# Altium project carrier.PrjPcb (part 1 of 3)
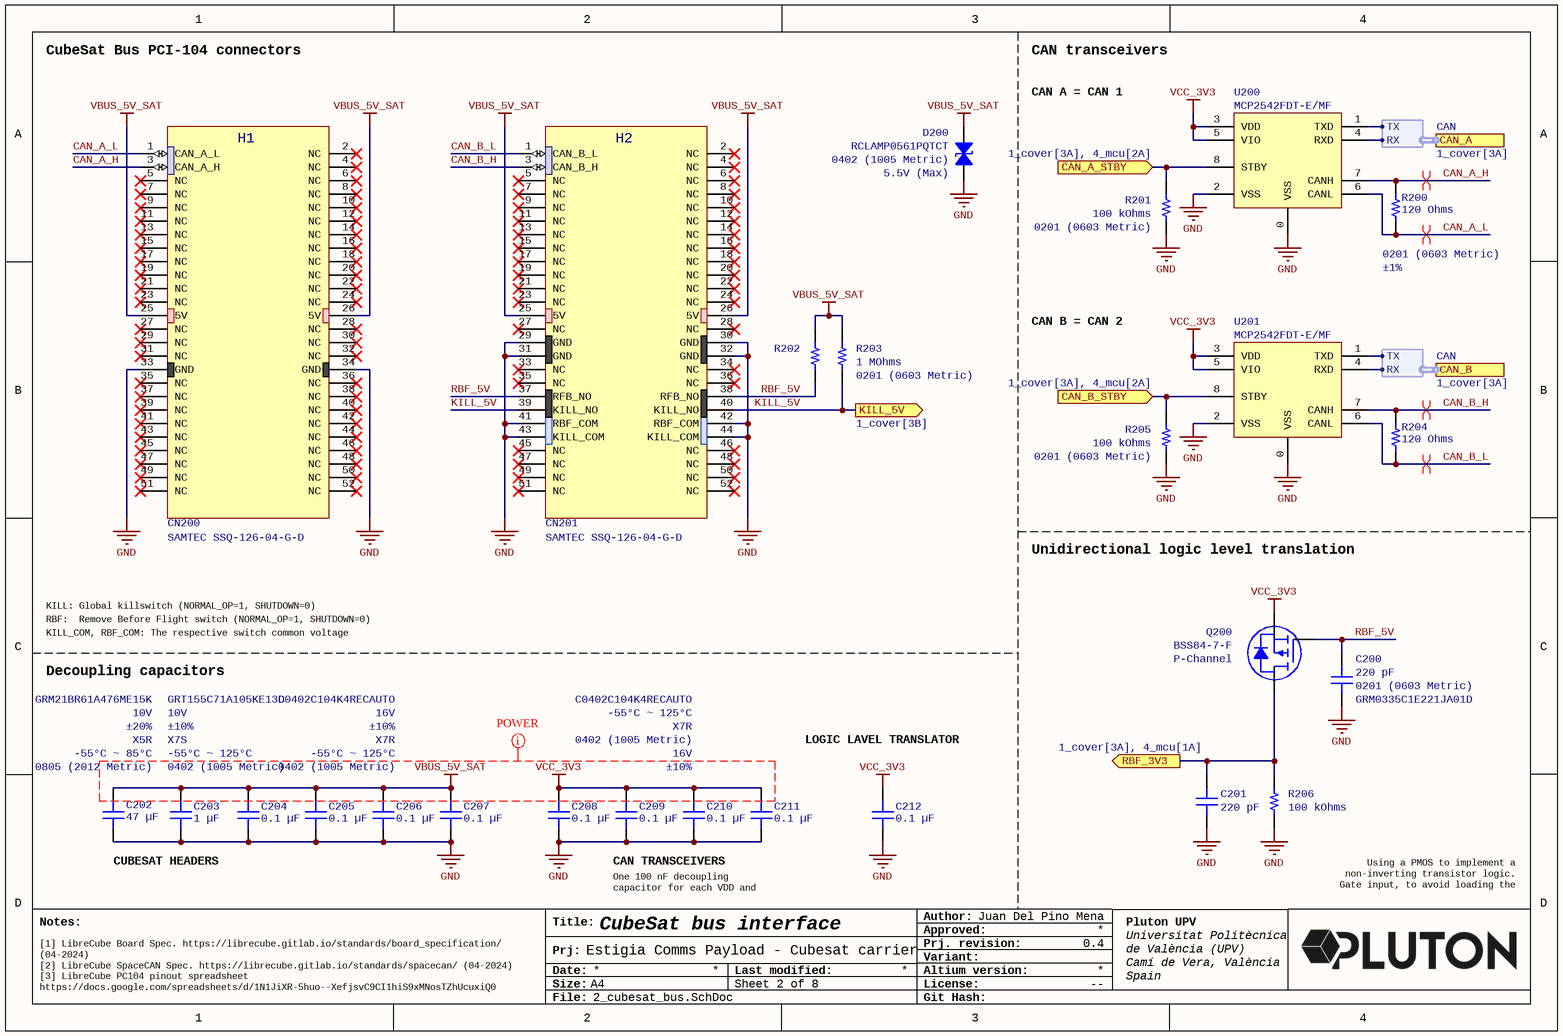
[diagram p0: 2_cubesat_bus.SchDoc]
Author: Juan Del Pino Mena; Organization: Pluton UPV; ProjectTitle: Estigia Comms Payload - Cubesat carrier; ProjectVersion: 0.4
6 sheets, 160 parts. Net scope: hierarchical (ports join the sheet entries above them; power ports are global).
Board file: carrier_pcb.PcbDoc
Sheets:
  2_cubesat_bus.SchDoc
  4_mcu.SchDoc
  5_rf_path.SchDoc
  6_power.SchDoc
  7_power_prot_mon.SchDoc
  8_ports.SchDoc

## Sheet 2_cubesat_bus.SchDoc: CubeSat bus interface
size A4; OrganizationName: Pluton UPV; Address1: Universitat Politècnica; Address2: de València (UPV); Address3: Camí de Vera, València; Address4: Spain; DocumentNumber: 2; Revision: 0.3; SheetNumber: 2; SheetTotal: 8

### Parts
C200  220 pF  Part Number: GRM0335C1E221JA01D  Device Package: 0201 (0603 Metric)  [CAP 0201_0603]
C201  220 pF  [CAP 0201_0603]
C202  Part Number: GRM21BR61A476ME15K  Device Package: 0805 (2012 Metric)  Operating Temperature: -55°C ~ 85°C  Temperature Coefficient: X5R  Tolerance: ±20%  Voltage - Rated: 10V  [CAP 0805_2012]  (hidden comment: 47 µF)
C203  Part Number: GRT155C71A105KE13D  Device Package: 0402 (1005 Metric)  Operating Temperature: -55°C ~ 125°C  Temperature Coefficient: X7S  Tolerance: ±10%  Voltage - Rated: 10V  [CAP 0402_1005]  (hidden comment: 1 µF)
C204  Part Number: C0402C104K4RECAUTO  Operating Temperature: -55°C ~ 125°C  Package / Case: 0402 (1005 Metric)  Temperature Coefficient: X7R  Tolerance: ±10%  Voltage - Rated: 16V  [CAP 0402_1005]  (hidden comment: 0.1 µF)
C205  0.1 µF  [CAP 0402_1005]
C206  0.1 µF  [CAP 0402_1005]
C207  0.1 µF  [CAP 0402_1005]
C208  0.1 µF  [CAP 0402_1005]
C209  Part Number: C0402C104K4RECAUTO  Operating Temperature: -55°C ~ 125°C  Package / Case: 0402 (1005 Metric)  Temperature Coefficient: X7R  Tolerance: ±10%  Voltage - Rated: 16V  [CAP 0402_1005]  (hidden comment: 0.1 µF)
C210  0.1 µF  [CAP 0402_1005]
C211  0.1 µF  [CAP 0402_1005]
C212  0.1 µF  [CAP 0402_1005]
CN200  SAMTEC SSQ-126-04-G-D  [SAMTEC SSQ-126-04-G-D]
CN201  SAMTEC SSQ-126-04-G-D  [SAMTEC SSQ-126-04-G-D]
D200  Device Package: 0402 (1005 Metric)  Voltage - Reverse Standoff (Typ): 5.5V (Max)  [0402]  (hidden comment: RCLAMP0561PQTCT)
Q200  FET Type: P-Channel  [DIODES SOT-23-3]  (hidden comment: BSS84-7-F)
R200  Device Package: 0201 (0603 Metric)  Tolerance: ±1%  [RES 0201_0603]  (hidden comment: 120 Ohms)
R201  Device Package: 0201 (0603 Metric)  [RES 0201_0603]  (hidden comment: 100 kOhms)
R202  1 MOhms  [RES 0201_0603]  (value not drawn)
R203  Device Package: 0201 (0603 Metric)  [RES 0201_0603]  (hidden comment: 1 MOhms)
R204  120 Ohms  [RES 0201_0603]
R205  Device Package: 0201 (0603 Metric)  [RES 0201_0603]  (hidden comment: 100 kOhms)
R206  100 kOhms  [RES 0201_0603]
U200  MCP2542FDT-E/MF  [DFN-8 3x3mm]
U201  MCP2542FDT-E/MF  [DFN-8 3x3mm]

### Ports
CAN_A (harness CAN, see 1_cover[3A]), CAN_A_STBY (in, see 1_cover[3A], 4_mcu[2A]), CAN_B (harness CAN, see 1_cover[3A]), CAN_B_STBY (in, see 1_cover[3A], 4_mcu[2A]), KILL_5V (out, see 1_cover[3B]), RBF_3V3 (out, see 1_cover[3A], 4_mcu[1A])

### Harnesses
CAN: RX, TX

### Nets
GND: C200.1 C201.1 C202.1 C203.1 C204.1 C205.1 C206.1 C207.1 C208.1 C209.1 C210.1 C211.1 C212.1 CN200.33(GND) CN200.34(GND) CN201.29(GND) CN201.30(GND) CN201.31(GND) CN201.32(GND) CN201.41(RBF_COM) CN201.42(RBF_COM) CN201.43(KILL_COM) CN201.44(KILL_COM) D200.1 R201.1 R205.1 R206.2 U200.0(VSS) U200.2(VSS) U201.0(VSS) U201.2(VSS)
VBUS_5V_SAT: C202.2 C203.2 C204.2 C205.2 C206.2 C207.2 CN200.25(5V) CN200.26(5V) CN201.25(5V) CN201.26(5V) D200.2 R202.2 R203.2
VCC_3V3: C208.2 C209.2 C210.2 C211.2 C212.2 Q200.2(S) U200.3(VDD) U200.5(VIO) U201.3(VDD) U201.5(VIO)
CAN_A_H: CN200.3(CAN_A_H) R200.2 U200.7(CANH)  [project net CAN_A_H_2]
CAN_A_L: CN200.1(CAN_A_L) R200.1 U200.6(CANL)  [project net CAN_A_L_2]
CAN_A_STBY: R201.2 U200.8(STBY) ; port CAN_A_STBY
CAN_B_H: CN201.3(CAN_B_H) R204.2 U201.7(CANH)  [project net CAN_B_H_2]
CAN_B_L: CN201.1(CAN_B_L) R204.1 U201.6(CANL)  [project net CAN_B_L_2]
CAN_B_STBY: R205.2 U201.8(STBY) ; port CAN_B_STBY
KILL_5V: CN201.39(KILL_NO) CN201.40(KILL_NO) R203.1 ; port KILL_5V
RBF_3V3: C201.2 Q200.3(D) R206.1 ; port RBF_3V3
RBF_5V: C200.2 CN201.37(RFB_NO) CN201.38(RFB_NO) Q200.1(G) R202.1  [project net RBF_5V_2]
NetU200_1: U200.1(TXD) ; port CAN_A.TX
NetU200_4: U200.4(RXD) ; port CAN_A.RX
NetU201_1: U201.1(TXD) ; port CAN_B.TX
NetU201_4: U201.4(RXD) ; port CAN_B.RX

Not connected (* = marked no-connect by the designer): CN200 2(NC)* 4(NC)* 5(NC)* 6(NC)* 7(NC)* 8(NC)* 9(NC)* 10(NC)* 11(NC)* 12(NC)* 13(NC)* 14(NC)* 15(NC)* 16(NC)* 17(NC)* 18(NC)* 19(NC)* 20(NC)* 21(NC)* 22(NC)* 23(NC)* 24(NC)* 27(NC)* 28(NC)* 29(NC)* 30(NC)* 31(NC)* 32(NC)* 35(NC)* 36(NC)* 37(NC)* 38(NC)* 39(NC)* 40(NC)* 41(NC)* 42(NC)* 43(NC)* 44(NC)* 45(NC)* 46(NC)* 47(NC)* 48(NC)* 49(NC)* 50(NC)* 51(NC)* 52(NC)*; CN201 2(NC)* 4(NC)* 5(NC)* 6(NC)* 7(NC)* 8(NC)* 9(NC)* 10(NC)* 11(NC)* 12(NC)* 13(NC)* 14(NC)* 15(NC)* 16(NC)* 17(NC)* 18(NC)* 19(NC)* 20(NC)* 21(NC)* 22(NC)* 23(NC)* 24(NC)* 27(NC)* 28(NC)* 33(NC)* 34(NC)* 35(NC)* 36(NC)* 45(NC)* 46(NC)* 47(NC)* 48(NC)* 49(NC)* 50(NC)* 51(NC)* 52(NC)*

### Layout directives
differential pair: CAN_A_H_2, CAN_A_L_2, CAN_B_H_2, CAN_B_L_2
rule Width Constraint [Pref Width = 0.4mm    Min Width = 0.2mm    Max Width = 2mm]; net class POWER: VBUS_5V_SAT, VCC_3V3

### Notes on the sheet
- CubeSat Bus PCI-104 connectors
- CAN transceivers
- CAN A = CAN 1
- CAN B = CAN 2
- Unidirectional logic level translation
- RBF:  Remove Before Flight switch (NORMAL_OP=1, SHUTDOWN=0)
- KILL: Global killswitch (NORMAL_OP=1, SHUTDOWN=0)
- KILL_COM, RBF_COM: The respective switch common voltage
- Decoupling capacitors
- LOGIC LAVEL TRANSLATOR
- CUBESAT HEADERS
- One 100 nF decoupling capacitor for each VDD and VIO pins [4]
- CAN TRANSCEIVERS
- Using a PMOS to implement a non-inverting transistor logic. Gate input, to avoid loading the line.
- [1] LibreCube Board Spec. https://librecube.gitlab.io/standards/board_specification/ (04-2024)
  [2] LibreCube SpaceCAN Spec. https://librecube.gitlab.io/standards/spacecan/ (04-2024)
  [3] LibreCube PC104 pinout spreadsheet
  https://docs.google.com/spreadsheets/d/1N1JiXR-5huo--XefjsvC9CI1hiS9xMNosTZhUcuxiQ0 (04-2024)
  [4] Microchip Inc. MCP2542FD/4FD MCP2542WFD/4WFD datasheet, DS20005514C, 2020
- Notes:
- Title:
- Author:
- Approved:
- Date:
- Prj:
- Size:
- A4
- Last modified:
- Altium version:
- Variant:
- Prj. revision:
- License:
- --
- File:
- Git Hash:
- (in symbol CubeSat Header H1 LoRa PL) H1
- (in symbol CubeSat Header H2 LoRa PL) H2

### Library data of the parts
C200 C201 = GRM0335C1E221JA01D: CAP CER 220PF 25V C0G/NP0 0201; manufacturer: Murata Electronics; Temperature Coefficient: C0G, NP0; Tolerance: ±5%; Value: 220 pF; Applications: General Purpose; Capacitance: 220 pF; componentlink2description: DigiKey Link; componentlink2url: https://www.digikey.com/en/products/detail/murata-electronics/GRM0335C1E221JA01D/10697031; lastupdated: 04/06/2024 19:01:01; Lifecycle Status: Active; Minimum Order: 1; Mounting Type: Surface Mount, MLCC; Operating Temperature: -55°C ~ 125°C; Package / Case: 0201 (0603 Metric); packaging: CutTape; partid: 46083; Part Status: Active; price: 0.01; series: GRM; Size / Dimension: 0.024" L x 0.012" W (0.60mm x 0.30mm); Supplier 1: DigiKey; Supplier Part Number 1: 490-GRM0335C1E221JA01DCT-ND; Thickness (Max): 0.013" (0.33mm); Voltage - Rated: 25V
  C201: Part Number: GRM0335C1E221JA01D; Device Package: 0201 (0603 Metric)
C202 = GRM21BR61A476ME15K: CAP CER 47UF 10V X5R 0805; manufacturer: Murata Electronics; Value: 47 µF; Applications: General Purpose; Capacitance: 47 µF; componentlink1description: Datasheet; componentlink1url: https://www.murata.com/-/media/webrenewal/support/library/catalog/products/capacitor/ceramiccapacitor/c02e.ashx?la=en-us&cvid=20210120024548000000; componentlink2description: DigiKey Link; componentlink2url: https://www.digikey.com/en/products/detail/murata-electronics/GRM21BR61A476ME15K/4905528; lastupdated: 09/02/2024 20:14:59; Lifecycle Status: Active; Minimum Order: 1; Mounting Type: Surface Mount, MLCC; Package / Case: 0805 (2012 Metric); packaging: TapeAndReel; partid: 44285; Part Status: Active; price: 0.13; series: GRM; Size / Dimension: 0.079" L x 0.049" W (2.00mm x 1.25mm); Supplier 1: DigiKey; Supplier Part Number 1: 490-GRM21BR61A476ME15KCT-ND; Thickness (Max): 0.057" (1.45mm)
C203 = GRT155C71A105KE13D: CAP CER 1UF 10V X7S 0402; manufacturer: Murata Electronics; Value: 1 µF; Applications: Automotive; Capacitance: 1 µF; componentlink1description: Datasheet; componentlink1url: https://search.murata.co.jp/Ceramy/image/img/A01X/G101/ENG/GRT155C71A105KE13-01.pdf; componentlink2description: DigiKey Link; componentlink2url: https://www.digikey.com/en/products/detail/murata-electronics/GRT155C71A105KE13D/10695747; lastupdated: 09/02/2024 20:04:05; Lifecycle Status: Active; Minimum Order: 1; Mounting Type: Surface Mount, MLCC; Package / Case: 0402 (1005 Metric); packaging: TapeAndReel; partid: 47127; Part Status: Active; price: 0.04; Ratings: AEC-Q200; series: GRT; Size / Dimension: 0.039" L x 0.020" W (1.00mm x 0.50mm); Supplier 1: DigiKey; Supplier Part Number 1: 490-GRT155C71A105KE13DCT-ND; Thickness (Max): 0.024" (0.60mm)
C204-C212 = C0402C104K4RECAUTO: CAP CER 0402 0.1UF 16V X7R 10%; manufacturer: KEMET; Value: 0.1 µF; Applications: Automotive, ESD Protection; Capacitance: 0.1 µF; componentlink1description: Datasheet; componentlink1url: https://api.kemet.com/component-edge/download/datasheet/C0402C104K4RECAUTO.pdf; componentlink2description: DigiKey Link; componentlink2url: https://www.digikey.com/en/products/detail/kemet/C0402C104K4RECAUTO/8563695; Device Package: 0402 (1005 Metric); lastupdated: 09/02/2024 20:04:38; Lifecycle Status: Active; Minimum Order: 1; Mounting Type: Surface Mount, MLCC; packaging: TapeAndReel; partid: 1731; Part Status: Active; price: 0.01; Ratings: AEC-Q200; series: ESD SMD Auto X7R; Size / Dimension: 0.039" L x 0.020" W (1.00mm x 0.50mm); Supplier 1: DigiKey; Supplier Part Number 1: 399-17167-1-ND; Thickness (Max): 0.022" (0.55mm)
  C205-C208 C210-C212: Part Number: C0402C104K4RECAUTO; Operating Temperature: -55°C ~ 125°C; Package / Case: 0402 (1005 Metric); Temperature Coefficient: X7R; Tolerance: ±10%; Voltage - Rated: 16V
CN200 = CubeSat Header H1 LoRa PL: LoRa Payload only pins SAMTEC SSQ-126-04-G-D; System: Connector
CN201 = CubeSat Header H2 LoRa PL: LoRa Payload only pins; System: Connector
D200 = RCLAMP0561PQTCT: 1-LINE 5V 0.15PF 1.1R ESD SLP100; Manufacturer: Semtech Corporation; Bidirectional Channels: 1; Capacitance @ Frequency: 0.14pF @ 1MHz; Current - Peak Pulse (10/1000µs): 2A (8/20µs); Power Line Protection: No; Power - Peak Pulse: 40W; Type: Zener; Voltage - Breakdown (Min): 6.5V; Voltage - Clamping (Max) @ Ipp: 20V; Part Number: RCLAMP0561PQTCT; Applications: HDMI, USB; ComponentLink1Description: Datasheet; ComponentLink1URL: https://semtech.my.salesforce.com/sfc/p/#E0000000JelG/a/2R000000UtDi/1jVA5kaukM6E3zuZeKc6Qe4VpVKspnyk2AdLBSY77Ow; ComponentLink2Description: DigiKey Link; ComponentLink2URL: https://www.digikey.com/en/products/detail/semtech-corporation/RCLAMP0561PQTCT/20370677; LastUpdated: 03/06/2024 20:22:58; Lifecycle Status: Active; Minimum Order: 1; Mounting Type: Surface Mount; Operating Temperature: -40°C ~ 125°C (TJ); Package / Case: 0402 (1005 Metric); Packaging: TapeAndReel; PartId: 11797; Price: 0.13; Series: RailClamp®; Supplier 1: DigiKey; Supplier Part Number 1: 600-RCLAMP0561PQTCT-ND; Supplier Device Package: SLP1006P2
Q200 = BSS84-7-F: MOSFET P-CH 50V 130MA SOT23-3; Manufacturer: Diodes Incorporated; Current - Continuous Drain (Id) @ 25°C: 130mA (Ta); Drive Voltage (Max Rds On,  Min Rds On): 5V; Input Capacitance (Ciss) (Max) @ Vds: 45 pF @ 25 V; Power Dissipation (Max): 300mW (Ta); Rds On (Max) @ Id, Vgs: 10Ohm @ 100mA, 5V; Vgs (Max): ±20V; Vgs(th) (Max) @ Id: 2V @ 1mA; Part Number: BSS84-7-F; ComponentLink1Description: Datasheet; ComponentLink1URL: https://www.diodes.com/assets/Datasheets/ds30149.pdf; ComponentLink2Description: DigiKey Link; ComponentLink2URL: https://www.digikey.com/en/products/detail/diodes-incorporated/BSS84-7-F/717724; Drain to Source Voltage (Vdss): 50 V; LastUpdated: 03/06/2024 20:15:20; Lifecycle Status: Active; Minimum Order: 1; Mounting Type: Surface Mount; Operating Temperature: -55°C ~ 150°C (TJ); Package / Case: TO-236-3, SC-59, SOT-23-3; Packaging: TapeAndReel; Part Status: Active; Price: 0.02; Series: -; Supplier 1: DigiKey; Supplier Part Number 1: BSS84-FDICT-ND; Supplier Device Package: SOT-23-3; Technology: MOSFET (Metal Oxide)
R200 R204 = CRCW0201120RFNED: RES SMD 120 OHM 1% 1/20W 0201; Manufacturer: Vishay Dale; Power (Watts): 0.05W, 1/20W; Temperature Coefficient: ±200ppm/°C; Part Number: CRCW0201120RFNED; Value: 120 Ohms; ComponentLink1Description: Datasheet; ComponentLink1URL: http://www.vishay.com/docs/20052/crcw0201e3.pdf; ComponentLink2Description: DigiKey Link; ComponentLink2URL: https://www.digikey.com/en/products/detail/vishay-dale/CRCW0201120RFNED/1199704; Composition: Thick Film; Height - Seated (Max): 0.010" (0.26mm); LastUpdated: 04/06/2024 19:11:56; Lifecycle Status: Active; Minimum Order: 1; Number of Terminations: 2; Operating Temperature: -55°C ~ 155°C; Package / Case: 0201 (0603 Metric); Packaging: TapeAndReel; PartId: 2072; Part Status: Active; Price: 0.01; Resistance: 120 Ohms; Series: CRCW0201 e3; Size / Dimension: 0.024" L x 0.012" W (0.60mm x 0.30mm); Supplier 1: DigiKey; Supplier Part Number 1: 541-CRCW0201120RFNEDCT-ND; Supplier Device Package: 201
  R204: Device Package: 0201 (0603 Metric); Tolerance: ±1%
R201 R205 R206 = RC0201FR-13100KL: RES 100K OHM 1% 1/20W 0201; Manufacturer: Yageo; Power (Watts): 0.05W, 1/20W; Temperature Coefficient: ±200ppm/°C; Part Number: RC0201FR-13100KL; Value: 100 kOhms; ComponentLink1Description: Datasheet; ComponentLink1URL: https://www.yageo.com/upload/media/product/productsearch/datasheet/rchip/PYu-RC_Group_51_RoHS_L_12.pdf; ComponentLink2Description: DigiKey Link; ComponentLink2URL: https://www.digikey.com/en/products/detail/yageo/RC0201FR-13100KL/17014509; Composition: Thick Film; Features: Moisture Resistant; Height - Seated (Max): 0.010" (0.26mm); LastUpdated: 04/06/2024 19:11:47; Lifecycle Status: Active; Minimum Order: 1; Number of Terminations: 2; Operating Temperature: -55°C ~ 125°C; Package / Case: 0201 (0603 Metric); Packaging: CutTape; PartId: 80199; Price: 0.01; Resistance: 100 kOhms; Series: RC_L; Size / Dimension: 0.024" L x 0.012" W (0.60mm x 0.30mm); Supplier 1: DigiKey; Supplier Part Number 1: 13-RC0201FR-13100KLCT-ND; Supplier Device Package: 0201; Tolerance: ±1%
  R206: Device Package: 0201 (0603 Metric)
R202 R203 = CRCW02011M00JNED: RES SMD 1M OHM 5% 1/20W 0201; Manufacturer: Vishay Dale; Power (Watts): 0.05W, 1/20W; Temperature Coefficient: ±200ppm/°C; Part Number: CRCW02011M00JNED; Value: 1 MOhms; ComponentLink1Description: Datasheet; ComponentLink1URL: http://www.vishay.com/docs/20052/crcw0201e3.pdf; ComponentLink2Description: DigiKey Link; ComponentLink2URL: https://www.digikey.com/en/products/detail/vishay-dale/CRCW02011M00JNED/1199588; Composition: Thick Film; Height - Seated (Max): 0.010" (0.26mm); LastUpdated: 04/06/2024 19:12:01; Lifecycle Status: Active; Minimum Order: 1; Number of Terminations: 2; Operating Temperature: -55°C ~ 155°C; Package / Case: 0201 (0603 Metric); Packaging: TapeAndReel; PartId: 493; Part Status: Active; Price: 0.01; Resistance: 1 MOhms; Series: CRCW0201 e3; Size / Dimension: 0.024" L x 0.012" W (0.60mm x 0.30mm); Supplier 1: DigiKey; Supplier Part Number 1: 541-CRCW02011M00JNEDCT-ND; Supplier Device Package: 201; Tolerance: ±5%
  R202: Device Package: 0201 (0603 Metric)
U200 U201 = CAN MCP2542FDT-E/MF: IC TRANSCEIVER 1/1 8DFN; Manufacturer: Microchip Technology; Data Rate: 8Mbps; Protocol: CANbus; Receiver Hysteresis: 200mV; Voltage - Supply: 4.5V ~ 5.5V; ComponentLink1Description: Datasheet; ComponentLink1URL: http://www.microchip.com/mymicrochip/filehandler.aspx?ddocname=en585412; ComponentLink2Description: DigiKey Link; ComponentLink2URL: http://digikey.com/product-detail/en/microchip-technology/MCP2542FDT-E-MF/MCP2542FDT-E-MFCT-ND/5975779; Device Package: 8-VDFN Exposed Pad; LastUpdated: 24/05/2020 23:09:12; Lifecycle Status: Active; Minimum Order: 1; Mounting Type: Surface Mount; Number of Drivers/Receivers: 1/1; Operating Temperature: -40°C ~ 125°C; Package / Case: 8-VDFN Exposed Pad; Packaging: TapeAndReel; Part Status: Active; Price: 0.62; Series: -; Supplier 1: DigiKey; Supplier Part Number 1: MCP2542FDT-E/MFCT-ND; Supplier Device Package: 8-DFN (3x3); Type: Transceiver; Part Number: MCP2542FDT-E/MF

## Sheet 4_mcu.SchDoc: Microcontroller
size A4; OrganizationName: Pluton UPV; Address1: Universitat Politècnica; Address2: de València (UPV); Address3: Camí de Vera, València; Address4: Spain; SheetNumber: 4; SheetTotal: 8
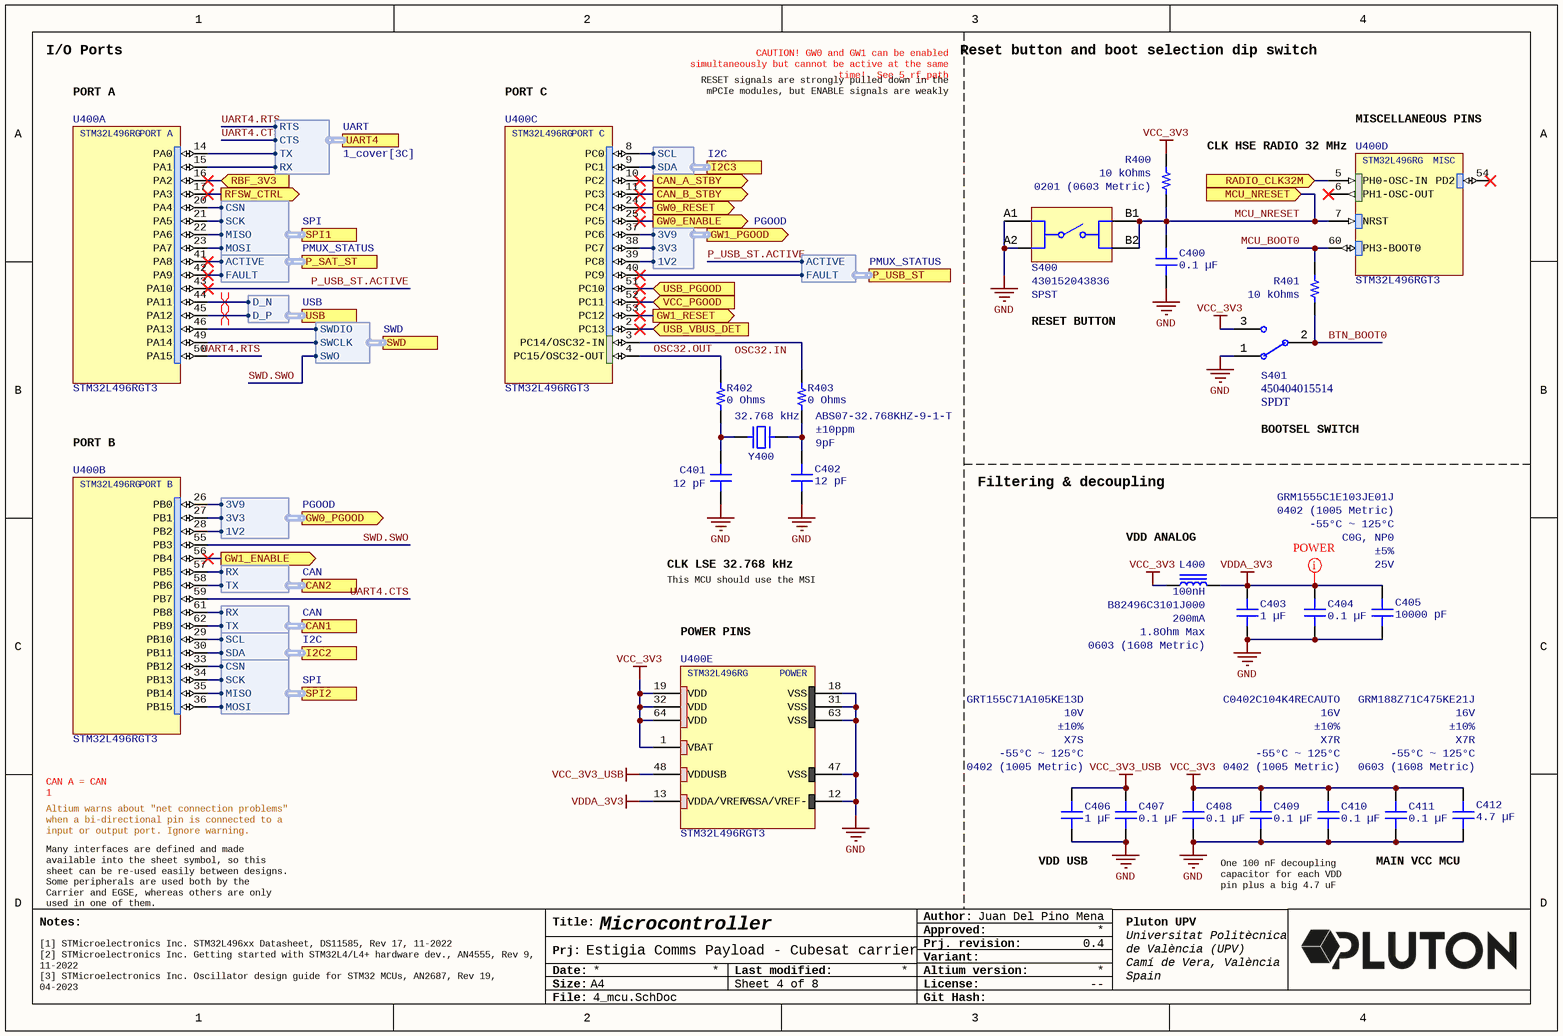
[diagram p1: 4_mcu.SchDoc]

### Parts
C400  0.1 µF  [CAP 0402_1005]
C401  12 pF  [CAP 0201_0603]
C402  12 pF  [CAP 0201_0603]
C403  1 µF  [CAP 0402_1005]
C404  0.1 µF  [CAP 0402_1005]
C405  Part Number: GRM1555C1E103JE01J  Device Package: 0402 (1005 Metric)  Operating Temperature: -55°C ~ 125°C  Temperature Coefficient: C0G, NP0  Tolerance: ±5%  Voltage - Rated: 25V  [CAP 0402_1005]  (hidden comment: 10000 pF)
C406  Part Number: GRT155C71A105KE13D  Device Package: 0402 (1005 Metric)  Operating Temperature: -55°C ~ 125°C  Temperature Coefficient: X7S  Tolerance: ±10%  Voltage - Rated: 10V  [CAP 0402_1005]  (hidden comment: 1 µF)
C407  0.1 µF  [CAP 0402_1005]
C408  0.1 µF  [CAP 0402_1005]
C409  Part Number: C0402C104K4RECAUTO  Operating Temperature: -55°C ~ 125°C  Package / Case: 0402 (1005 Metric)  Temperature Coefficient: X7R  Tolerance: ±10%  Voltage - Rated: 16V  [CAP 0402_1005]  (hidden comment: 0.1 µF)
C410  0.1 µF  [CAP 0402_1005]
C411  0.1 µF  [CAP 0402_1005]
C412  Part Number: GRM188Z71C475KE21J  Device Package: 0603 (1608 Metric)  Operating Temperature: -55°C ~ 125°C  Temperature Coefficient: X7R  Tolerance: ±10%  Voltage - Rated: 16V  [CAP 0603_1608]  (hidden comment: 4.7 µF)
L400  100nH  Part Number: B82496C3101J000  Current Rating (Amps): 200mA  DC Resistance (DCR): 1.8Ohm Max  Device Package: 0603 (1608 Metric)  [IND 0603_1608 RF WW]
R400  Package / Case: 0201 (0603 Metric)  [RES 0201_0603]  (hidden comment: 10 kOhms)
R401  10 kOhms  [RES 0201_0603]
R402  0 Ohms  [RES 0201_0603]
R403  0 Ohms  [RES 0201_0603]
S400  430152043836  Throw Configuration: SPST  [WS-TASV_L6W6H4.3_4301x20438x6]
S401  Circuit: SPDT  [WURTH WS-SLSU 450404015514]  (hidden comment: 450404015514)
U400  STM32L496RGT3  [LQFP64]  (parts A,B,C,D,E of 5)
Y400  Part Number: ABS07-32.768KHZ-9-1-T  Frequency Tolerance: ±10ppm  Load Capacitance: 9pF  [ABRACON ABS07]  (hidden comment: 32.768 kHz)

### Ports
CAN1 (harness CAN, see 1_cover[3A]), CAN2 (harness CAN, see 1_cover[3A]), CAN_A_STBY (out, see 1_cover[3A], 2_cubesat_bus[3A]), CAN_B_STBY (out, see 1_cover[3A], 2_cubesat_bus[3B]), GW0_ENABLE (out, see 1_cover[3B], 3_mpcie[2B]), GW0_PGOOD (out, harness PGOOD, see 1_cover[3B], 3_mpcie[2B]), GW0_RESET (out, see 1_cover[3B], 3_mpcie[2A]), GW1_ENABLE (out, see 1_cover[3B], 3_mpcie[4B]), GW1_PGOOD (out, harness PGOOD, see 1_cover[3B], 3_mpcie[4B]), GW1_RESET (out, see 1_cover[3B], 3_mpcie[4A]), I2C2 (harness I2C, see 1_cover[3B]), I2C3 (harness I2C, see 1_cover[3B]), MCU_NRESET (in, see 1_cover[3C], 8_ports[3A]), P_SAT_ST (harness PMUX_STATUS, see 1_cover[3C]), P_USB_ST (harness PMUX_STATUS, see 1_cover[3C]), RADIO_CLK32M (in, see 1_cover[3B]), RBF_3V3 (in, see 1_cover[3A], 2_cubesat_bus[3C]), RFSW_CTRL (out, see 1_cover[3C], 5_rf_path[2B]), SPI1 (harness SPI, see 1_cover[3B]), SPI2 (harness SPI, see 1_cover[3B]), SWD (harness SWD, see 1_cover[3C], 8_ports[3A]), UART4 (harness UART, see 1_cover[3C]), USB (harness USB, see 1_cover[3C], 8_ports[3C]), USB_PGOOD (in, see 1_cover[3B], 6_power[1C]), USB_VBUS_DET (in, see 1_cover[3B], 8_ports[4C]), VCC_PGOOD (in, see 1_cover[3B], 6_power[1A])

### Harnesses
SPI: CSN, SCK, MISO, MOSI
CAN: RX, TX
I2C: SCL, SDA
SWD: SWDIO, SWCLK, SWO
USB: D_N, D_P
PGOOD: 1V2, 3V3, 3V9
UART: TX, RX, CTS, RTS
PMUX_STATUS: ACTIVE, FAULT

### Nets
GND: C400.1 C401.1 C402.1 C403.1 C404.1 C405.1 C406.1 C407.1 C408.1 C409.1 C410.1 C411.1 C412.1 S400.A1 S400.A2 S401.1 U400.12(VSSA/VREF-) U400.18(VSS) U400.31(VSS) U400.47(VSS) U400.63(VSS)
VCC_3V3: C408.2 C409.2 C410.2 C411.2 C412.2 L400.1 R400.2 S401.3 U400.1(VBAT) U400.19(VDD) U400.32(VDD) U400.64(VDD)
VCC_3V3_USB: C406.2 C407.2 U400.48(VDDUSB)
VDDA_3V3: C403.2 C404.2 C405.2 L400.2 U400.13(VDDA/VREF+)
BTN_BOOT0: R401.1 S401.2(COM)  [project net BTN_BOOT0_4]
CAN_A_STBY: U400.10(PC2) ; port CAN_A_STBY
CAN_B_STBY: U400.11(PC3) ; port CAN_B_STBY
GW0_ENABLE: U400.25(PC5) ; port GW0_ENABLE
GW0_RESET: U400.24(PC4) ; port GW0_RESET
GW1_ENABLE: U400.56(PB4) ; port GW1_ENABLE
GW1_RESET: U400.53(PC12) ; port GW1_RESET
MCU_BOOT0: R401.2 U400.60(PH3-BOOT0)  [project net MCU_BOOT0_4]
MCU_NRESET: C400.2 R400.1 S400.B1 S400.B2 U400.7(NRST) ; port MCU_NRESET
OSC32.IN: R403.2 U400.3(PC14/OSC32-IN)  [project net OSC32.IN_4]
OSC32.OUT: R402.2 U400.4(PC15/OSC32-OUT)  [project net OSC32.OUT_4]
P_USB_ST.ACTIVE: U400.43(PA10) ; port P_USB_ST.ACTIVE
RADIO_CLK32M: U400.5(PH0-OSC-IN) ; port RADIO_CLK32M
RBF_3V3: U400.16(PA2) ; port RBF_3V3
RFSW_CTRL: U400.17(PA3) ; port RFSW_CTRL
SWD.SWO: U400.55(PB3) ; port SWD.SWO
UART4.CTS: U400.59(PB7) ; port UART4.CTS
UART4.RTS: U400.50(PA15) ; port UART4.RTS
USB_PGOOD: U400.51(PC10) ; port USB_PGOOD
USB_VBUS_DET: U400.2(PC13) ; port USB_VBUS_DET
VCC_PGOOD: U400.52(PC11) ; port VCC_PGOOD
NetC401_2: C401.2 R402.1 Y400.1
NetC402_2: C402.2 R403.1 Y400.2
NetU400_8: U400.8(PC0) ; port I2C3.SCL
NetU400_9: U400.9(PC1) ; port I2C3.SDA
NetU400_14: U400.14(PA0) ; port UART4.TX
NetU400_15: U400.15(PA1) ; port UART4.RX
NetU400_20: U400.20(PA4) ; port SPI1.CSN
NetU400_21: U400.21(PA5) ; port SPI1.SCK
NetU400_22: U400.22(PA6) ; port SPI1.MISO
NetU400_23: U400.23(PA7) ; port SPI1.MOSI
NetU400_26: U400.26(PB0) ; port GW0_PGOOD.3V9
NetU400_27: U400.27(PB1) ; port GW0_PGOOD.3V3
NetU400_28: U400.28(PB2) ; port GW0_PGOOD.1V2
NetU400_29: U400.29(PB10) ; port I2C2.SCL
NetU400_30: U400.30(PB11) ; port I2C2.SDA
NetU400_33: U400.33(PB12) ; port SPI2.CSN
NetU400_34: U400.34(PB13) ; port SPI2.SCK
NetU400_35: U400.35(PB14) ; port SPI2.MISO
NetU400_36: U400.36(PB15) ; port SPI2.MOSI
NetU400_37: U400.37(PC6) ; port GW1_PGOOD.3V9
NetU400_38: U400.38(PC7) ; port GW1_PGOOD.3V3
NetU400_39: U400.39(PC8) ; port GW1_PGOOD.1V2
NetU400_40: U400.40(PC9) ; port P_USB_ST.FAULT
NetU400_41: U400.41(PA8) ; port P_SAT_ST.ACTIVE
NetU400_42: U400.42(PA9) ; port P_SAT_ST.FAULT
NetU400_44: U400.44(PA11) ; port USB.D_N
NetU400_45: U400.45(PA12) ; port USB.D_P
NetU400_46: U400.46(PA13) ; port SWD.SWDIO
NetU400_49: U400.49(PA14) ; port SWD.SWCLK
NetU400_57: U400.57(PB5) ; port CAN2.RX
NetU400_58: U400.58(PB6) ; port CAN2.TX
NetU400_61: U400.61(PB8) ; port CAN1.RX
NetU400_62: U400.62(PB9) ; port CAN1.TX

Not connected (* = marked no-connect by the designer): U400 6(PH1-OSC-OUT)* 54(PD2)*

### Layout directives
differential pair: NetU400_44, NetU400_45
rule Width Constraint [Pref Width = 0.4mm    Min Width = 0.3mm    Max Width = 0.5mm]; net class POWER: VDDA_3V3

### Notes on the sheet
- I/O Ports
- PORT A
- PORT C
- CAUTION! GW0 and GW1 can be enabled simultaneously but cannot be active at the same time!. See 5_rf_path
- RESET signals are strongly pulled down in the mPCIe modules, but ENABLE signals are weakly pulled low.
- Reset button and boot selection dip switch
- CLK HSE RADIO 32 MHz
- MISCELLANEOUS PINS
- RESET BUTTON
- PORT B
- BOOTSEL SWITCH
- Filtering & decoupling
- CLK LSE 32.768 kHz
- This MCU should use the MSI clock
- (near L400) VDD ANALOG
- POWER PINS
- CAN A = CAN 1
  CAN B = CAN 2
- Altium warns about "net connection problems" when a bi-directional pin is connected to a input or output port. Ignore warning.
- Many interfaces are defined and made available into the sheet symbol, so this sheet can be re-used easily between designs. Some peripherals are used both by the Carrier and EGSE, whereas others are only used in one of them.
- (near C406) VDD USB
- One 100 nF decoupling capacitor for each VDD pin plus a big 4.7 uF cap [2]
- MAIN VCC MCU
- [1] STMicroelectronics Inc. STM32L496xx Datasheet, DS11585, Rev 17, 11-2022
  [2] STMicroelectronics Inc. Getting started with STM32L4/L4+ hardware dev., AN4555, Rev 9, 11-2022
  [3] STMicroelectronics Inc. Oscillator design guide for STM32 MCUs, AN2687, Rev 19, 04-2023
- Notes:
- Title:
- Author:
- Approved:
- Date:
- Prj:
- Size:
- A4
- Last modified:
- Altium version:
- Variant:
- Prj. revision:
- License:
- --
- File:
- Git Hash:
- (in symbol STM32L496RGT3, part A) STM32L496RG; PORT A
- (in symbol STM32L496RGT3, part B) STM32L496RG; PORT B
- (in symbol STM32L496RGT3, part C) STM32L496RG; PORT C
- (in symbol STM32L496RGT3, part D) STM32L496RG; MISC
- (in symbol STM32L496RGT3, part E) STM32L496RG; POWER

### Library data of the parts
C400 C404 C407-C411 = C0402C104K4RECAUTO: as C204 on sheet 2_cubesat_bus; Value: 0.1 µF; Applications: Automotive, ESD Protection; Capacitance: 0.1 µF; componentlink1description: Datasheet; componentlink1url: https://api.kemet.com/component-edge/download/datasheet/C0402C104K4RECAUTO.pdf; componentlink2description: DigiKey Link; componentlink2url: https://www.digikey.com/en/products/detail/kemet/C0402C104K4RECAUTO/8563695; Device Package: 0402 (1005 Metric); lastupdated: 09/02/2024 20:04:38; Lifecycle Status: Active; Minimum Order: 1; Mounting Type: Surface Mount, MLCC; packaging: TapeAndReel; partid: 1731; Part Status: Active; price: 0.01; Ratings: AEC-Q200; series: ESD SMD Auto X7R; Size / Dimension: 0.039" L x 0.020" W (1.00mm x 0.50mm); Supplier 1: DigiKey; Supplier Part Number 1: 399-17167-1-ND; Thickness (Max): 0.022" (0.55mm)
  C400 C404 C407 C408 C410 C411: Part Number: C0402C104K4RECAUTO; Operating Temperature: -55°C ~ 125°C; Package / Case: 0402 (1005 Metric); Temperature Coefficient: X7R; Tolerance: ±10%; Voltage - Rated: 16V
C401 C402 = CBR02C120F3GAC: CAP CER 12PF 25V C0G/NP0 0201; manufacturer: KEMET; Temperature Coefficient: C0G, NP0; Tolerance: ±1%; Part Number: CBR02C120F3GAC; Value: 12 pF; Applications: RF, Microwave, High Frequency; Capacitance: 12 pF; componentlink1description: Datasheet; componentlink1url: https://api.kemet.com/component-edge/download/datasheet/CBR02C120F3GAC.pdf; componentlink2description: DigiKey Link; componentlink2url: https://www.digikey.com/en/products/detail/kemet/CBR02C120F3GAC/3479199; Device Package: 0201 (0603 Metric); Features: High Q, Low Loss, Ultra Low ESR; lastupdated: 04/06/2024 19:01:11; Lifecycle Status: Active; Minimum Order: 1; Mounting Type: Surface Mount, MLCC; Operating Temperature: -55°C ~ 125°C; Package / Case: 0201 (0603 Metric); packaging: TapeAndReel; partid: 143; Part Status: Active; price: 0.07; series: CBR-SMD RF C0G; Size / Dimension: 0.024" L x 0.012" W (0.60mm x 0.30mm); Supplier 1: DigiKey; Supplier Part Number 1: 399-8604-1-ND; Thickness (Max): 0.013" (0.33mm); Voltage - Rated: 25V
C403 = GRT155C71A105KE13D: CAP CER 1UF 10V X7S 0402; manufacturer: Murata Electronics; Tolerance: ±10%; Part Number: GRT155C71A105KE13D; Value: 1 µF; Applications: Automotive; Capacitance: 1 µF; componentlink1description: Datasheet; componentlink1url: https://search.murata.co.jp/Ceramy/image/img/A01X/G101/ENG/GRT155C71A105KE13-01.pdf; componentlink2description: DigiKey Link; componentlink2url: https://www.digikey.com/en/products/detail/murata-electronics/GRT155C71A105KE13D/10695747; Device Package: 0402 (1005 Metric); lastupdated: 09/02/2024 20:04:05; Lifecycle Status: Active; Minimum Order: 1; Mounting Type: Surface Mount, MLCC; Operating Temperature: -55°C ~ 125°C; Package / Case: 0402 (1005 Metric); packaging: TapeAndReel; partid: 47127; Part Status: Active; price: 0.04; Ratings: AEC-Q200; series: GRT; Size / Dimension: 0.039" L x 0.020" W (1.00mm x 0.50mm); Supplier 1: DigiKey; Supplier Part Number 1: 490-GRT155C71A105KE13DCT-ND; Temperature Coefficient: X7S; Thickness (Max): 0.024" (0.60mm); Voltage - Rated: 10V
C405 = GRM1555C1E103JE01J: CAP CER 10000PF 25V C0G/NP0 0402; manufacturer: Murata Electronics; Value: 10000 pF; Applications: General Purpose; Capacitance: 10000 pF; componentlink1description: Datasheet; componentlink1url: https://search.murata.co.jp/Ceramy/image/img/A01X/G101/ENG/GRM1555C1E103JE01-01A.pdf; componentlink2description: DigiKey Link; componentlink2url: https://www.digikey.com/en/products/detail/murata-electronics/GRM1555C1E103JE01J/16033801; lastupdated: 09/02/2024 20:04:09; Lifecycle Status: Active; Minimum Order: 1; Mounting Type: Surface Mount, MLCC; Package / Case: 0402 (1005 Metric); packaging: TapeAndReel; partid: 41084; Part Status: Active; price: 0.02; series: GRM; Size / Dimension: 0.039" L x 0.020" W (1.00mm x 0.50mm); Supplier 1: DigiKey; Supplier Part Number 1: 490-GRM1555C1E103JE01JCT-ND; Thickness (Max): 0.026" (0.65mm)
C406 = GRT155C71A105KE13D: as C203 on sheet 2_cubesat_bus; Value: 1 µF; Applications: Automotive; Capacitance: 1 µF; componentlink1description: Datasheet; componentlink1url: https://search.murata.co.jp/Ceramy/image/img/A01X/G101/ENG/GRT155C71A105KE13-01.pdf; componentlink2description: DigiKey Link; componentlink2url: https://www.digikey.com/en/products/detail/murata-electronics/GRT155C71A105KE13D/10695747; lastupdated: 09/02/2024 20:04:05; Lifecycle Status: Active; Minimum Order: 1; Mounting Type: Surface Mount, MLCC; Package / Case: 0402 (1005 Metric); packaging: TapeAndReel; partid: 47127; Part Status: Active; price: 0.04; Ratings: AEC-Q200; series: GRT; Size / Dimension: 0.039" L x 0.020" W (1.00mm x 0.50mm); Supplier 1: DigiKey; Supplier Part Number 1: 490-GRT155C71A105KE13DCT-ND; Thickness (Max): 0.024" (0.60mm)
C412 = GRM188Z71C475KE21J: CAP CER 4.7UF 16V X7R 0603; manufacturer: Murata Electronics; Value: 4.7 µF; Applications: General Purpose; Capacitance: 4.7 µF; componentlink1description: Datasheet; componentlink1url: https://search.murata.co.jp/Ceramy/image/img/A01X/G101/ENG/GRM188Z71C475KE21-01A.pdf; componentlink2description: DigiKey Link; componentlink2url: https://www.digikey.com/en/products/detail/murata-electronics/GRM188Z71C475KE21J/16033436; lastupdated: 09/02/2024 20:09:51; Lifecycle Status: Active; Minimum Order: 1; Mounting Type: Surface Mount, MLCC; Package / Case: 0603 (1608 Metric); packaging: TapeAndReel; partid: 41988; Part Status: Active; price: 0.04; series: GRM; Size / Dimension: 0.063" L x 0.031" W (1.60mm x 0.80mm); Supplier 1: DigiKey; Supplier Part Number 1: 490-GRM188Z71C475KE21JCT-ND; Thickness (Max): 0.039" (1.00mm)
L400 = B82496C3101J000: FIXED IND 100NH 200MA 1.8 OHM; Manufacturer: TDK Electronics Inc.; Frequency - Self Resonant: 1.8GHz; Inductance Frequency - Test: 100MHz; Material - Core: Ceramic; Q @ Freq: 14 @ 100MHz; Shielding: Unshielded; Tolerance: ±5%; Type: Wirewound; ComponentLink1Description: Datasheet; ComponentLink1URL: https://www.tdk-electronics.tdk.com/inf/30/db/ind_2008/b82496c.pdf; ComponentLink2Description: DigiKey Link; ComponentLink2URL: http://digikey.com/product-detail/en/tdk-electronics-inc/B82496C3101J000/495-1825-1-ND/697680; Inductance: 100nH; LastUpdated: 06/09/2020 11:05:16; Lifecycle Status: Active; Minimum Order: 1; Mounting Type: Surface Mount; Operating Temperature: -55°C ~ 150°C; Package / Case: 0603 (1608 Metric); Packaging: TapeAndReel; PartId: 755; Part Status: Active; Price: 0.16; Ratings: AEC-Q200; Series: SIMID; Supplier 1: DigiKey; Supplier Part Number 1: 495-1825-1-ND; Supplier Device Package: 0603 (1608 Metric); Value: 100nH
R400 R401 = AF0201FR-0710KL: RES SMD 10K OHM 1% 1/20W 0201; Manufacturer: Yageo; Power (Watts): 0.05W, 1/20W; Temperature Coefficient: ±200ppm/°C; Part Number: AF0201FR-0710KL; Value: 10 kOhms; ComponentLink1Description: Datasheet; ComponentLink1URL: https://www.yageo.com/upload/media/product/productsearch/datasheet/rchip/PYu-AF_51_RoHS_L_9.pdf; ComponentLink2Description: DigiKey Link; ComponentLink2URL: https://www.digikey.com/en/products/detail/yageo/AF0201FR-0710KL/5900138; Composition: Thick Film; Device Package: 0201 (0603 Metric); Features: Anti-Sulfur, Automotive AEC-Q200; Height - Seated (Max): 0.010" (0.26mm); LastUpdated: 04/06/2024 19:11:47; Lifecycle Status: Active; Minimum Order: 1; Number of Terminations: 2; Operating Temperature: -55°C ~ 125°C; Packaging: TapeAndReel; PartId: 78061; Part Status: Active; Price: 0.01; Ratings: AEC-Q200; Resistance: 10 kOhms; Series: AF; Size / Dimension: 0.024" L x 0.012" W (0.60mm x 0.30mm); Supplier 1: DigiKey; Supplier Part Number 1: 13-AF0201FR-0710KLCT-ND; Supplier Device Package: 0201; Tolerance: ±1%
  R401: Package / Case: 0201 (0603 Metric)
R402 R403 = AC0201JR-070RL: RES SMD 0 OHM JUMPER 1/20W 0201; Manufacturer: Yageo; Power (Watts): 0.05W, 1/20W; Part Number: AC0201JR-070RL; Value: 0 Ohms; ComponentLink1Description: Datasheet; ComponentLink1URL: https://www.yageo.com/upload/media/product/productsearch/datasheet/rchip/PYu-AC_51_RoHS_L_7.pdf; ComponentLink2Description: DigiKey Link; ComponentLink2URL: https://www.digikey.com/en/products/detail/yageo/AC0201JR-070RL/5894880; Composition: Thick Film; Device Package: 0201 (0603 Metric); Features: Automotive AEC-Q200, Moisture Resistant; Height - Seated (Max): 0.010" (0.26mm); LastUpdated: 04/06/2024 19:12:00; Lifecycle Status: Active; Minimum Order: 1; Number of Terminations: 2; Operating Temperature: -55°C ~ 155°C; Package / Case: 0201 (0603 Metric); Packaging: CutTape; PartId: 818; Part Status: Active; Price: 0.01; Ratings: AEC-Q200; Resistance: 0 Ohms; Series: AC; Size / Dimension: 0.024" L x 0.012" W (0.60mm x 0.30mm); Supplier 1: DigiKey; Supplier Part Number 1: YAG3427CT-ND; Supplier Device Package: 0201; Tolerance: Jumper
S400 = CMP-1452-00002-2: NexarPartId: 22861785; Voltage Rating: 12V; Current Rating: 50mA; Switch Travel: 250µm; Switch Function: Off-Mom; Actuator Material: Liquid Crystal Polymer, Polymer; Insulation Resistance: 100MΩ; Actuator Length: 900µm; Mechanical Life: 200kcycles; Illumination Type: Illuminated, Non-Illuminated; Mount: Surface Mount; Max Operating Temperature: 85°C; Height: 4.3mm; RoHS: Compliant; Length: 6.2mm; Color: Orange; Width: 6.2mm; Contact Current Rating: 50mA; Diameter: 3.5mm; Termination: Gull Wing; Packaging: Tape and Reel; REACH SVHC: No SVHC; Contact Plating: Silver; Min Operating Temperature: -40°C; Contact Material: Stainless Steel, Steel
S401 = 450404015514: MINI SLIDE SWITCH 6.7 X 2.7 MM.; Manufacturer: Würth Elektronik; Rated Current: 300mA; Rated Voltage: 5VDC; Switching Function: On-On; Actuator Length: 1.50mm; Actuator Type: Standard; Contact Timing: Non-Shorting (BBM); Current Rating (Amps): 300mA (DC); Voltage Rating - DC: 5 V; ComponentLink1Description: Datasheet; ComponentLink1URL: https://katalog.we-online.de/em/datasheet/450404015514.pdf; ComponentLink2Description: DigiKey Link; ComponentLink2URL: https://www.digikey.com/en/products/detail/würth-elektronik/450404015514/9950812; Packaging: TapeAndReel; Publisher: Wurth Elektronik; Contact Material: Copper Alloy; Mounting Technology: SMT; Operating Temperature: -40°C ~ 85°C; Contact Plating: Silver; Part Number: 450404015514; Published Date: September 2019; Terminal Material: Copper Alloy; Size: 6.7x2.7mm; Terminal Plating: Silver; Contact Finish: Silver; LastUpdated: 20/06/2022 13:21:56; Lifecycle Status: Active; Minimum Order: 1; Mounting Type: Surface Mount; PartId: 5; Part Status: Active; Price: 0.48; Series: WS-SLSU; Supplier 1: DigiKey; Supplier Part Number 1: 732-13665-1-ND; Switch Function: On-On; Termination Style: SMD (SMT) Tab
U400 = STM32L496RGT3: Ultra-low-power Arm® Cortex®-M4 32-bit MCU+FPU, 100 DMIPS, up to 1 MB flash, 320 KB SRAM, USB OTG FS, audio, LQFP64
Y400 = ABS07-32.768KHZ-9-1-T: CRYSTAL 32.7680KHZ 9PF SMD; Manufacturer: Abracon LLC; ESR (Equivalent Series Resistance): 70 kOhms; Operating Mode: Fundamental; ComponentLink1Description: Datasheet; ComponentLink1URL: https://abracon.com/Resonators/ABS07.pdf; ComponentLink2Description: DigiKey Link; ComponentLink2URL: https://www.digikey.com/en/products/detail/abracon-llc/ABS07-32-768KHZ-9-1-T/5980075; Frequency: 32.768 kHz; Height - Seated (Max): 0.035" (0.90mm); LastUpdated: 03/06/2024 20:02:04; Lifecycle Status: Active; Minimum Order: 1; Mounting Type: Surface Mount; Operating Temperature: -40°C ~ 85°C; Package / Case: 2-SMD, No Lead; Packaging: TapeAndReel; PartId: 380; Part Status: Active; Price: 0.86; Series: ABS07; Size / Dimension: 0.126" L x 0.059" W (3.20mm x 1.50mm); Supplier 1: DigiKey; Supplier Part Number 1: 535-13479-1-ND; Type: kHz Crystal (Tuning Fork); Value: 32.768 kHz

## Sheet 5_rf_path.SchDoc: RF path selection
size A4; OrganizationName: Pluton UPV; Address1: Universitat Politècnica; Address2: de València (UPV); Address3: Camí de Vera, València; Address4: Spain; SheetNumber: 5; SheetTotal: 8
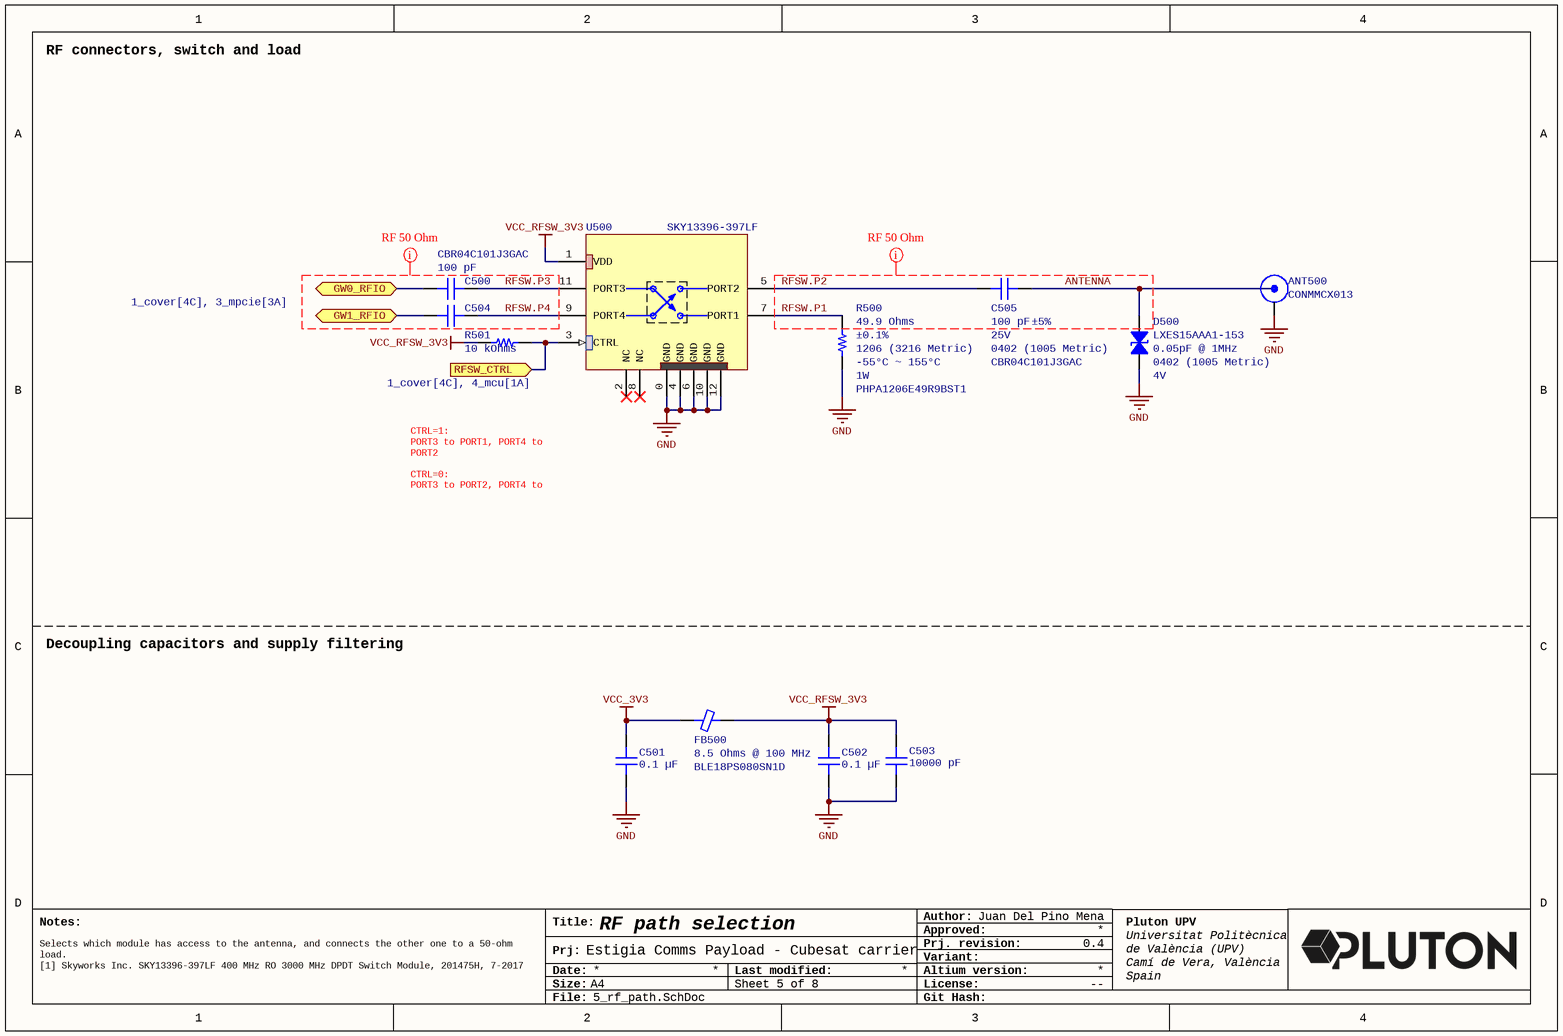
[diagram p2: 5_rf_path.SchDoc]

### Parts
ANT500  CONMMCX013  [CONMMCX013]
C500  Part Number: CBR04C101J3GAC  [CAP 0402_1005 RF]  (hidden comment: 100 pF)
C501  0.1 µF  [CAP 0402_1005]
C502  0.1 µF  [CAP 0402_1005]
C503  10000 pF  [CAP 0402_1005]
C504  100 pF  [CAP 0402_1005 RF]  (value not drawn)
C505  Part Number: CBR04C101J3GAC  Device Package: 0402 (1005 Metric)  Tolerance: ±5%  Voltage - Rated: 25V  [CAP 0402_1005 RF]  (hidden comment: 100 pF)
D500  Capacitance @ Frequency: 0.05pF @ 1MHz  Device Package: 0402 (1005 Metric)  Voltage - Reverse Standoff (Typ): 4V  [0402]  (hidden comment: LXES15AAA1-153)
FB500  Part Number: BLE18PS080SN1D  [FER 0603_1608]  (hidden comment: 8.5 Ohms @ 100 MHz)
R500  49.9 Ohms  Part Number: PHPA1206E49R9BST1  Device Package: 1206 (3216 Metric)  Operating Temperature: -55°C ~ 155°C  Power (Watts): 1W  Tolerance: ±0.1%  [RES 1206_3216]
R501  10 kOhms  [RES 0201_0603]
U500  SKY13396-397LF  [SKY13396-397LF]

### Ports
GW0_RFIO (bidir, see 1_cover[4C], 3_mpcie[1A]), GW1_RFIO (bidir, see 1_cover[4C], 3_mpcie[3A]), RFSW_CTRL (in, see 1_cover[4C], 4_mcu[1A])

### Nets
GND: ANT500.2(GND) C501.1 C502.1 C503.1 D500.1 R500.1 U500.0(GND) U500.4(GND) U500.6(GND) U500.10(GND) U500.12(GND)
VCC_3V3: C501.2 FB500.1
VCC_RFSW_3V3: C502.2 C503.2 FB500.2 R501.2 U500.1(VDD)
ANTENNA: ANT500.1(SIGNAL) C505.2 D500.2  [project net ANTENNA_5]
GW0_RFIO: C500.1 ; port GW0_RFIO
GW1_RFIO: C504.1 ; port GW1_RFIO
RFSW.P1: R500.2 U500.7(PORT1)  [project net RFSW.P1_5]
RFSW.P2: C505.1 U500.5(PORT2)  [project net RFSW.P2_5]
RFSW.P3: C500.2 U500.11(PORT3)  [project net RFSW.P3_5]
RFSW.P4: C504.2 U500.9(PORT4)  [project net RFSW.P4_5]
RFSW_CTRL: R501.1 U500.3(CTRL) ; port RFSW_CTRL

Not connected (* = marked no-connect by the designer): U500 2(NC)* 8(NC)*

### Layout directives
net class RF50; rule Width Constraint [Pref Impedance = 50.00ohms    Min Impedance = 50.00ohms    Max Impedance = 50.00ohms]: ANTENNA, RFSW.P1, RFSW.P2, RFSW.P3, RFSW.P4

### Notes on the sheet
- RF connectors, switch and load
- CTRL=1:
  PORT3 to PORT1, PORT4 to PORT2
  CTRL=0:
  PORT3 to PORT2, PORT4 to PORT1
- Decoupling capacitors and supply filtering
- Selects which module has access to the antenna, and connects the other one to a 50-ohm load.
  [1] Skyworks Inc. SKY13396-397LF 400 MHz RO 3000 MHz DPDT Switch Module, 201475H, 7-2017
- Notes:
- Title:
- Author:
- Approved:
- Date:
- Prj:
- Size:
- A4
- Last modified:
- Altium version:
- Variant:
- Prj. revision:
- License:
- --
- File:
- Git Hash:

### Library data of the parts
ANT500 = MMCX-CONMMCX013: MMCX Jack PCB Cutout Edge Mount Connector 0 to 8.5 GHz operation MMCX (female socket) connection
C500 C504 = CBR04C101J3GAC: CAP CER 100PF 25V C0G/NP0 0402; manufacturer: KEMET; Temperature Coefficient: C0G, NP0; Tolerance: ±5%; Applications: RF, Microwave, High Frequency; Capacitance: 100 pF; componentlink1description: Datasheet; componentlink1url: https://api.kemet.com/component-edge/download/datasheet/CBR04C101J3GAC.pdf; componentlink2description: DigiKey Link; componentlink2url: https://www.digikey.com/en/products/detail/kemet/CBR04C101J3GAC/8572519; Device Package: 0402 (1005 Metric); Features: High Q, Low Loss, Ultra Low ESR; lastupdated: 03/06/2024 19:38:14; Lifecycle Status: Active; Minimum Order: 1; Mounting Type: Surface Mount, MLCC; Operating Temperature: -55°C ~ 125°C; Package / Case: 0402 (1005 Metric); packaging: TapeAndReel; partid: 681; Part Status: Active; price: 0.02; series: CBR-SMD RF C0G; Size / Dimension: 0.039" L x 0.020" W (1.00mm x 0.50mm); Supplier 1: DigiKey; Supplier Part Number 1: 399-17684-1-ND; Thickness (Max): 0.022" (0.55mm); value: 100 pF; Voltage - Rated: 25V
  C504: Part Number: CBR04C101J3GAC
C501 C502 = C0402C104K4RECAUTO: as C204 on sheet 2_cubesat_bus; Part Number: C0402C104K4RECAUTO; Value: 0.1 µF; Applications: Automotive, ESD Protection; Capacitance: 0.1 µF; componentlink1description: Datasheet; componentlink1url: https://api.kemet.com/component-edge/download/datasheet/C0402C104K4RECAUTO.pdf; componentlink2description: DigiKey Link; componentlink2url: https://www.digikey.com/en/products/detail/kemet/C0402C104K4RECAUTO/8563695; Device Package: 0402 (1005 Metric); lastupdated: 09/02/2024 20:04:38; Lifecycle Status: Active; Minimum Order: 1; Mounting Type: Surface Mount, MLCC; Operating Temperature: -55°C ~ 125°C; Package / Case: 0402 (1005 Metric); packaging: TapeAndReel; partid: 1731; Part Status: Active; price: 0.01; Ratings: AEC-Q200; series: ESD SMD Auto X7R; Size / Dimension: 0.039" L x 0.020" W (1.00mm x 0.50mm); Supplier 1: DigiKey; Supplier Part Number 1: 399-17167-1-ND; Temperature Coefficient: X7R; Thickness (Max): 0.022" (0.55mm); Tolerance: ±10%; Voltage - Rated: 16V
C503 = GRM1555C1E103JE01J: CAP CER 10000PF 25V C0G/NP0 0402; manufacturer: Murata Electronics; Temperature Coefficient: C0G, NP0; Tolerance: ±5%; Part Number: GRM1555C1E103JE01J; Value: 10000 pF; Applications: General Purpose; Capacitance: 10000 pF; componentlink1description: Datasheet; componentlink1url: https://search.murata.co.jp/Ceramy/image/img/A01X/G101/ENG/GRM1555C1E103JE01-01A.pdf; componentlink2description: DigiKey Link; componentlink2url: https://www.digikey.com/en/products/detail/murata-electronics/GRM1555C1E103JE01J/16033801; Device Package: 0402 (1005 Metric); lastupdated: 09/02/2024 20:04:09; Lifecycle Status: Active; Minimum Order: 1; Mounting Type: Surface Mount, MLCC; Operating Temperature: -55°C ~ 125°C; Package / Case: 0402 (1005 Metric); packaging: TapeAndReel; partid: 41084; Part Status: Active; price: 0.02; series: GRM; Size / Dimension: 0.039" L x 0.020" W (1.00mm x 0.50mm); Supplier 1: DigiKey; Supplier Part Number 1: 490-GRM1555C1E103JE01JCT-ND; Thickness (Max): 0.026" (0.65mm); Voltage - Rated: 25V
C505 = CBR04C101J3GAC: CAP CER 100PF 25V C0G/NP0 0402; manufacturer: KEMET; Temperature Coefficient: C0G, NP0; Applications: RF, Microwave, High Frequency; Capacitance: 100 pF; componentlink1description: Datasheet; componentlink1url: https://api.kemet.com/component-edge/download/datasheet/CBR04C101J3GAC.pdf; componentlink2description: DigiKey Link; componentlink2url: https://www.digikey.com/en/products/detail/kemet/CBR04C101J3GAC/8572519; Features: High Q, Low Loss, Ultra Low ESR; lastupdated: 03/06/2024 19:38:14; Lifecycle Status: Active; Minimum Order: 1; Mounting Type: Surface Mount, MLCC; Operating Temperature: -55°C ~ 125°C; Package / Case: 0402 (1005 Metric); packaging: TapeAndReel; partid: 681; Part Status: Active; price: 0.02; series: CBR-SMD RF C0G; Size / Dimension: 0.039" L x 0.020" W (1.00mm x 0.50mm); Supplier 1: DigiKey; Supplier Part Number 1: 399-17684-1-ND; Thickness (Max): 0.022" (0.55mm); value: 100 pF
D500 = LXES15AAA1-153: TVS DIODE 4V 1005; Manufacturer: Murata Electronics; Bidirectional Channels: 1; Power Line Protection: No; Type: Zener; Part Number: LXES15AAA1-153; Applications: General Purpose; ComponentLink1Description: Datasheet; ComponentLink1URL: https://www.murata.com/en-us/products/productdata/8796832759838/CRESD-E.pdf; ComponentLink2Description: DigiKey Link; ComponentLink2URL: http://digikey.com/product-detail/en/murata-electronics/LXES15AAA1-153/490-13210-2-ND/5843762; LastUpdated: 03/06/2024 20:23:00; Lifecycle Status: Active; Minimum Order: 0; Mounting Type: Surface Mount; Operating Temperature: -40°C ~ 85°C (TA); Package / Case: 0402 (1005 Metric); Packaging: TapeAndReel; PartId: 10448; Part Status: Active; Price: 0.04; Series: -; Supplier 1: DigiKey; Supplier Part Number 1: 490-13210-2-ND; Supplier Device Package: 1005
FB500 = BLE18PS080SN1D: FERRITE BEAD 8.5 OHM 0603 1LN; Manufacturer: Murata Electronics; Current Rating (Max): 8A; DC Resistance (DCR) (Max): 4mOhm; Filter Type: Power Line; Number of Lines: 1; ComponentLink1Description: Datasheet; ComponentLink1URL: https://www.murata.com/products/productdata/8800169525278/ENFA0080.pdf; ComponentLink2Description: DigiKey Link; ComponentLink2URL: https://www.digikey.com/en/products/detail/murata-electronics/BLE18PS080SN1D/13904803; Device Package: 0603 (1608 Metric); Height (Max): 0.030" (0.75mm); Impedance @ Frequency: 8.5 Ohms @ 100 MHz; LastUpdated: 03/06/2024 19:51:46; Lifecycle Status: Active; Minimum Order: 1; Mounting Type: Surface Mount; Operating Temperature: -55°C ~ 125°C; Package / Case: 0603 (1608 Metric); Packaging: TapeAndReel; PartId: 2651; Part Status: Active; Price: 0.08; Series: EMIFIL®, BLE18; Size / Dimension: 0.063" L x 0.031" W (1.60mm x 0.80mm); Supplier 1: DigiKey; Supplier Part Number 1: 490-BLE18PS080SN1DCT-ND; Value: 8.5 Ohms @ 100 MHz
R500 = PHPA1206E49R9BST1: THIN FILM RES SMD 49.9 OHM 0.1%; Manufacturer: Vishay Dale Thin Film; Temperature Coefficient: ±25ppm/°C; ComponentLink1Description: Datasheet; ComponentLink1URL: https://www.vishay.com/docs/60160/phpa.pdf; ComponentLink2Description: DigiKey Link; ComponentLink2URL: https://www.digikey.com/en/products/detail/vishay-dale-thin-film/PHPA1206E49R9BST1/14555186; Composition: Thin Film; Features: Anti-Sulfur, Automotive AEC-Q200, High Power, Moisture Resistant; Height - Seated (Max): 0.020" (0.51mm); LastUpdated: 09/02/2024 20:53:25; Lifecycle Status: Active; Minimum Order: 1; Number of Terminations: 2; Package / Case: 1206 (3216 Metric); Packaging: TapeAndReel; PartId: 58771; Part Status: Active; Price: 0.76; Ratings: AEC-Q200; Resistance: 49.9 Ohms; Series: PHPA; Size / Dimension: 0.126" L x 0.063" W (3.20mm x 1.60mm); Supplier 1: DigiKey; Supplier Part Number 1: 764-PHPA1206E49R9BST1CT-ND; Supplier Device Package: 1206; Value: 49.9 Ohms
R501 = AF0201FR-0710KL: as R400 on sheet 4_mcu; Part Number: AF0201FR-0710KL; Value: 10 kOhms; ComponentLink1Description: Datasheet; ComponentLink1URL: https://www.yageo.com/upload/media/product/productsearch/datasheet/rchip/PYu-AF_51_RoHS_L_9.pdf; ComponentLink2Description: DigiKey Link; ComponentLink2URL: https://www.digikey.com/en/products/detail/yageo/AF0201FR-0710KL/5900138; Composition: Thick Film; Device Package: 0201 (0603 Metric); Features: Anti-Sulfur, Automotive AEC-Q200; Height - Seated (Max): 0.010" (0.26mm); LastUpdated: 04/06/2024 19:11:47; Lifecycle Status: Active; Minimum Order: 1; Number of Terminations: 2; Operating Temperature: -55°C ~ 125°C; Package / Case: 0201 (0603 Metric); Packaging: TapeAndReel; PartId: 78061; Part Status: Active; Price: 0.01; Ratings: AEC-Q200; Resistance: 10 kOhms; Series: AF; Size / Dimension: 0.024" L x 0.012" W (0.60mm x 0.30mm); Supplier 1: DigiKey; Supplier Part Number 1: 13-AF0201FR-0710KLCT-ND; Supplier Device Package: 0201; Tolerance: ±1%
U500 = SKY13396-397LF: 0.4 to 3.0 GHz DPDT Switch